# EAGLE schematic gnublin_ext_8080 (EAGLE 6.6.0)
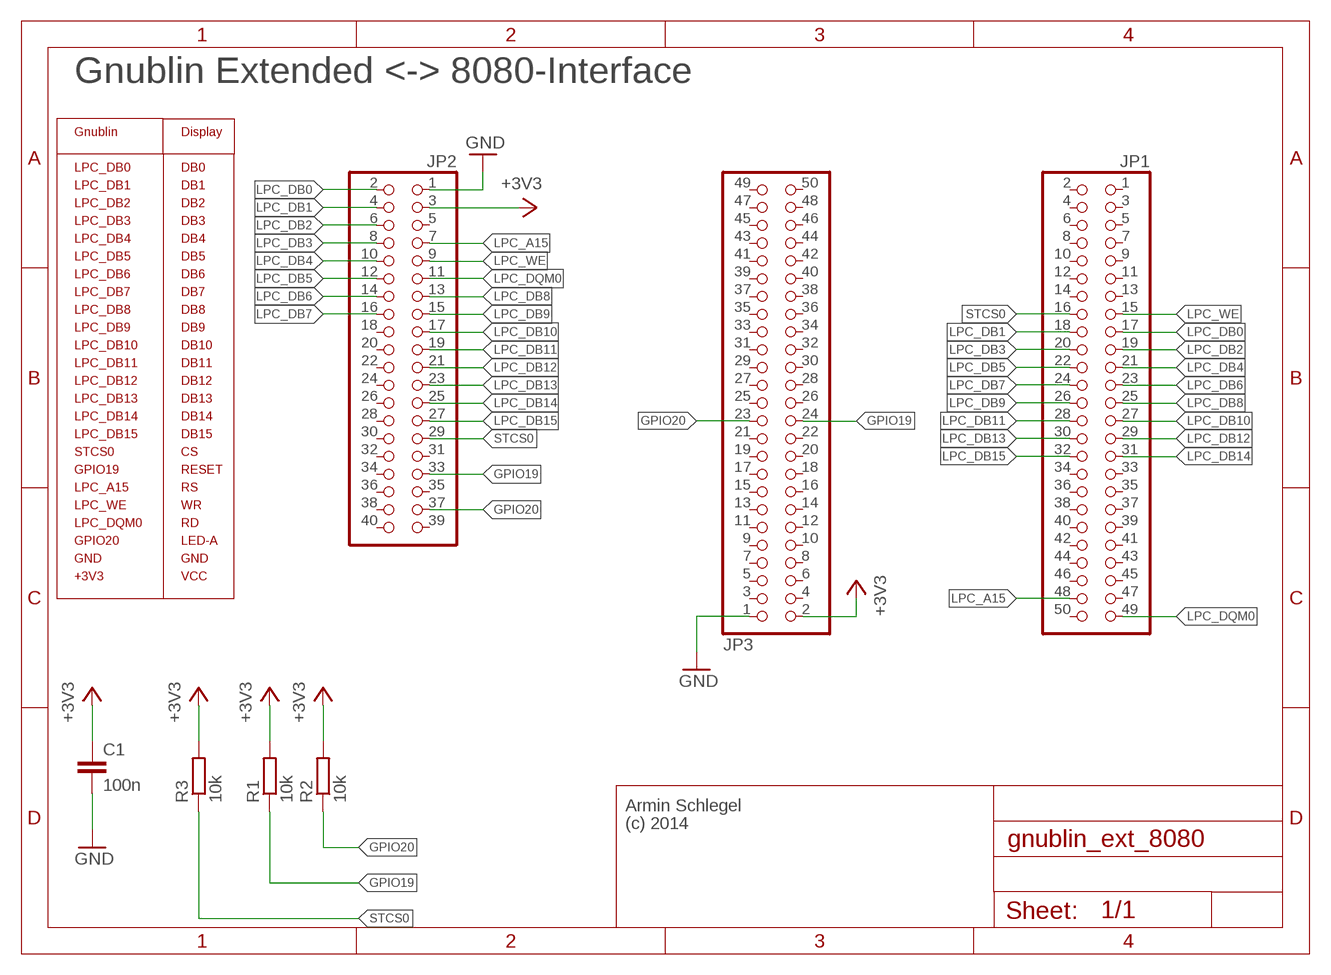
[diagram p0: schematic, sheet 1]

## Parts
C1  100n  C-EUC0805  [C0805]
JP1  PINHD-2X25_2.54-SMD  [2X25SMD]
JP2  PINHD-2X20  [2X20]
JP3  PINHD-2X25_2.54-SMD  [2X25SMD]
R1  10k  R-EU_R0603  [R0603]
R2  10k  R-EU_R0603  [R0603]
R3  10k  R-EU_R0603  [R0603]

## Nets
+3V3: C1.1 JP2.3 JP3.2 R1.2 R2.2 R3.2
GND: C1.2 JP2.1 JP3.1
GPIO19: JP2.33 JP3.24 R1.1
GPIO20: JP2.37 JP3.23 R2.1
LPC_A15: JP1.48 JP2.7
LPC_DB0: JP1.17 JP2.2
LPC_DB1: JP1.18 JP2.4
LPC_DB2: JP1.19 JP2.6
LPC_DB3: JP1.20 JP2.8
LPC_DB4: JP1.21 JP2.10
LPC_DB5: JP1.22 JP2.12
LPC_DB6: JP1.23 JP2.14
LPC_DB7: JP1.24 JP2.16
LPC_DB8: JP1.25 JP2.13
LPC_DB9: JP1.26 JP2.15
LPC_DB10: JP1.27 JP2.17
LPC_DB11: JP1.28 JP2.19
LPC_DB12: JP1.29 JP2.21
LPC_DB13: JP1.30 JP2.23
LPC_DB14: JP1.31 JP2.25
LPC_DB15: JP1.32 JP2.27
LPC_DQM0: JP1.49 JP2.11
LPC_WE: JP1.15 JP2.9
STCS0: JP1.16 JP2.29 R3.1
Unconnected: JP1.1 JP1.2 JP1.3 JP1.4 JP1.5 JP1.6 JP1.7 JP1.8 JP1.9 JP1.10 JP1.11 JP1.12 JP1.13 JP1.14 JP1.33 JP1.34 JP1.35 JP1.36 JP1.37 JP1.38 JP1.39 JP1.40 JP1.41 JP1.42 JP1.43 JP1.44 JP1.45 JP1.46 JP1.47 JP1.50 JP2.5 JP2.18 JP2.20 JP2.22 JP2.24 JP2.26 JP2.28 JP2.30 JP2.31 JP2.32 JP2.34 JP2.35 JP2.36 JP2.38 JP2.39 JP2.40 JP3.3 JP3.4 JP3.5 JP3.6 JP3.7 JP3.8 JP3.9 JP3.10 JP3.11 JP3.12 JP3.13 JP3.14 JP3.15 JP3.16 JP3.17 JP3.18 JP3.19 JP3.20 JP3.21 JP3.22 JP3.25 JP3.26 JP3.27 JP3.28 JP3.29 JP3.30 JP3.31 JP3.32 JP3.33 JP3.34 JP3.35 JP3.36 JP3.37 JP3.38 JP3.39 JP3.40 JP3.41 JP3.42 JP3.43 JP3.44 JP3.45 JP3.46 JP3.47 JP3.48 JP3.49 JP3.50

## Notes on the sheet
- Gnublin Extended <-> 8080-Interface
- Gnublin | Display
- LPC_DB0 | DB0
- LPC_DB1 | DB1
- LPC_DB2 | DB2
- LPC_DB3 | DB3
- LPC_DB4 | DB4
- LPC_DB5 | DB5
- LPC_DB6 | DB6
- LPC_DB7 | DB7
- LPC_DB8 | DB8
- LPC_DB9 | DB9
- LPC_DB10 | DB10
- LPC_DB11 | DB11
- LPC_DB12 | DB12
- LPC_DB13 | DB13
- LPC_DB14 | DB14
- LPC_DB15 | DB15
- STCS0 | CS
- GPIO19 | RESET
- LPC_A15 | RS
- LPC_WE | WR
- LPC_DQM0 | RD
- GPIO20 | LED-A
- GND | GND
- +3V3 | VCC
- Armin Schlegel
- (c) 2014

## Library data of the parts
C1 = rcl:C-EU: CAPACITOR, European symbol
JP1 JP3 = pinhead_smd:PINHD-2X25: PIN HEADER
JP2 = pinhead:PINHD-2X20: PIN HEADER
R1-R3 = rcl:R-EU_: RESISTOR, European symbol

## Net classes
0 default: width 0.254 mm, drill 0.7 mm, clearance 0.254 mm